# Altium project NBP7 Xilinx Virtex-II BGA456 Rev1.10.PrjPcb
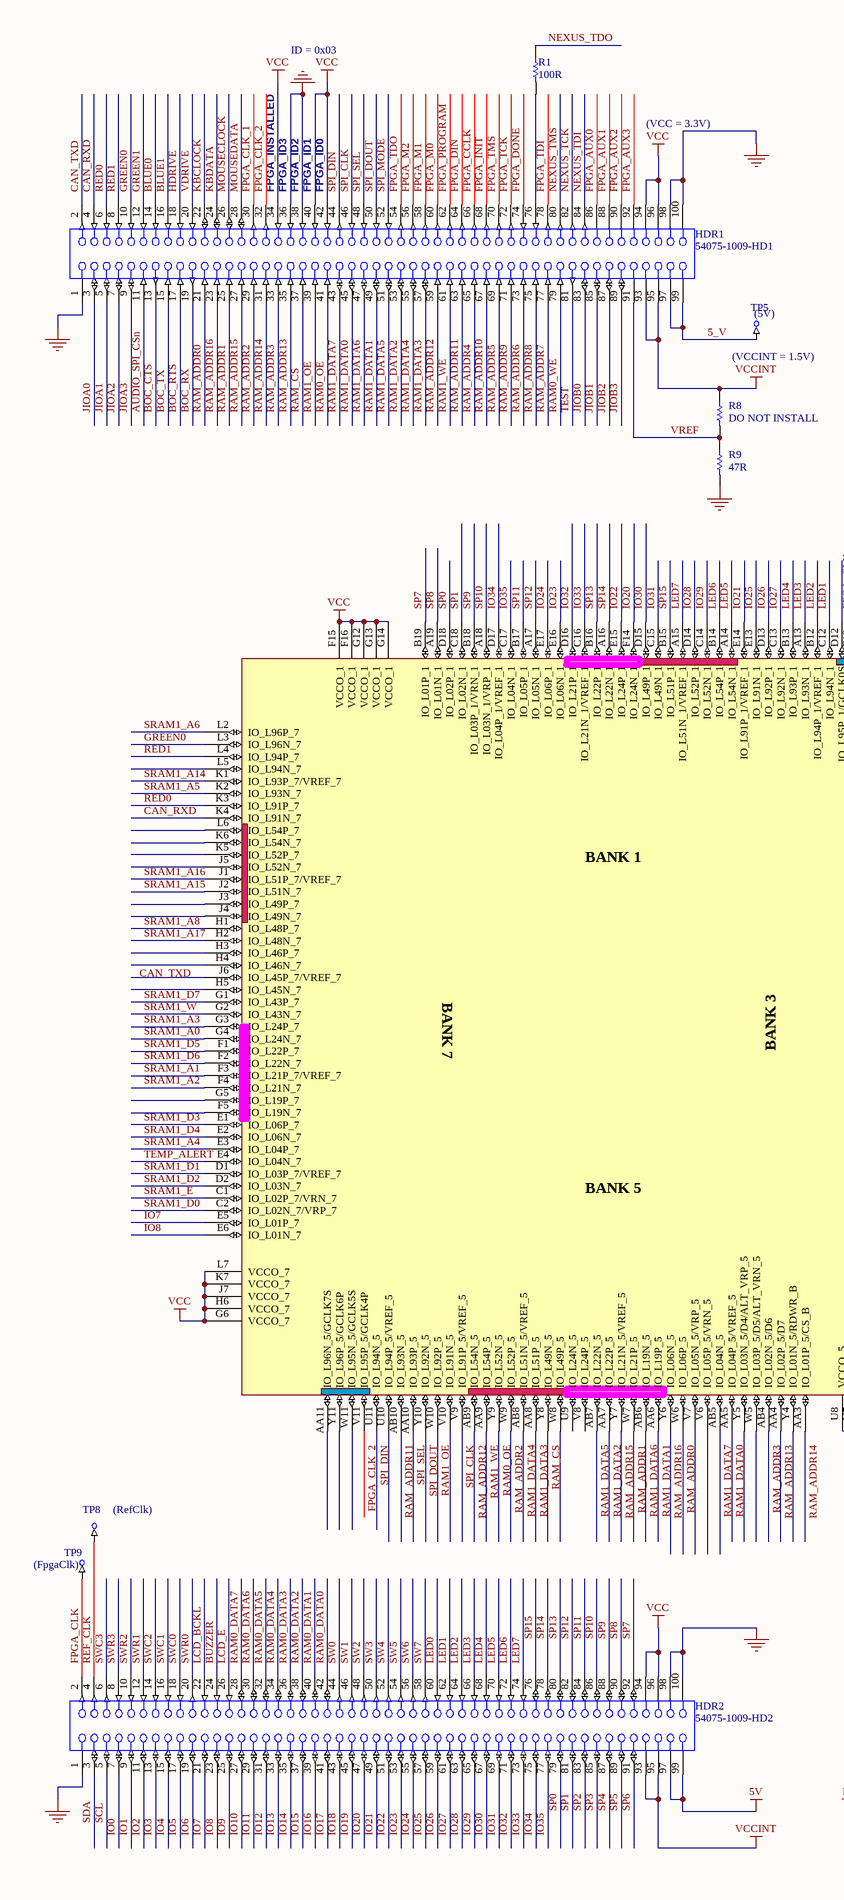
[diagram p0: NBP7 Xilinx Virtex-II BGA456 Rev1.10.SchDoc, left]
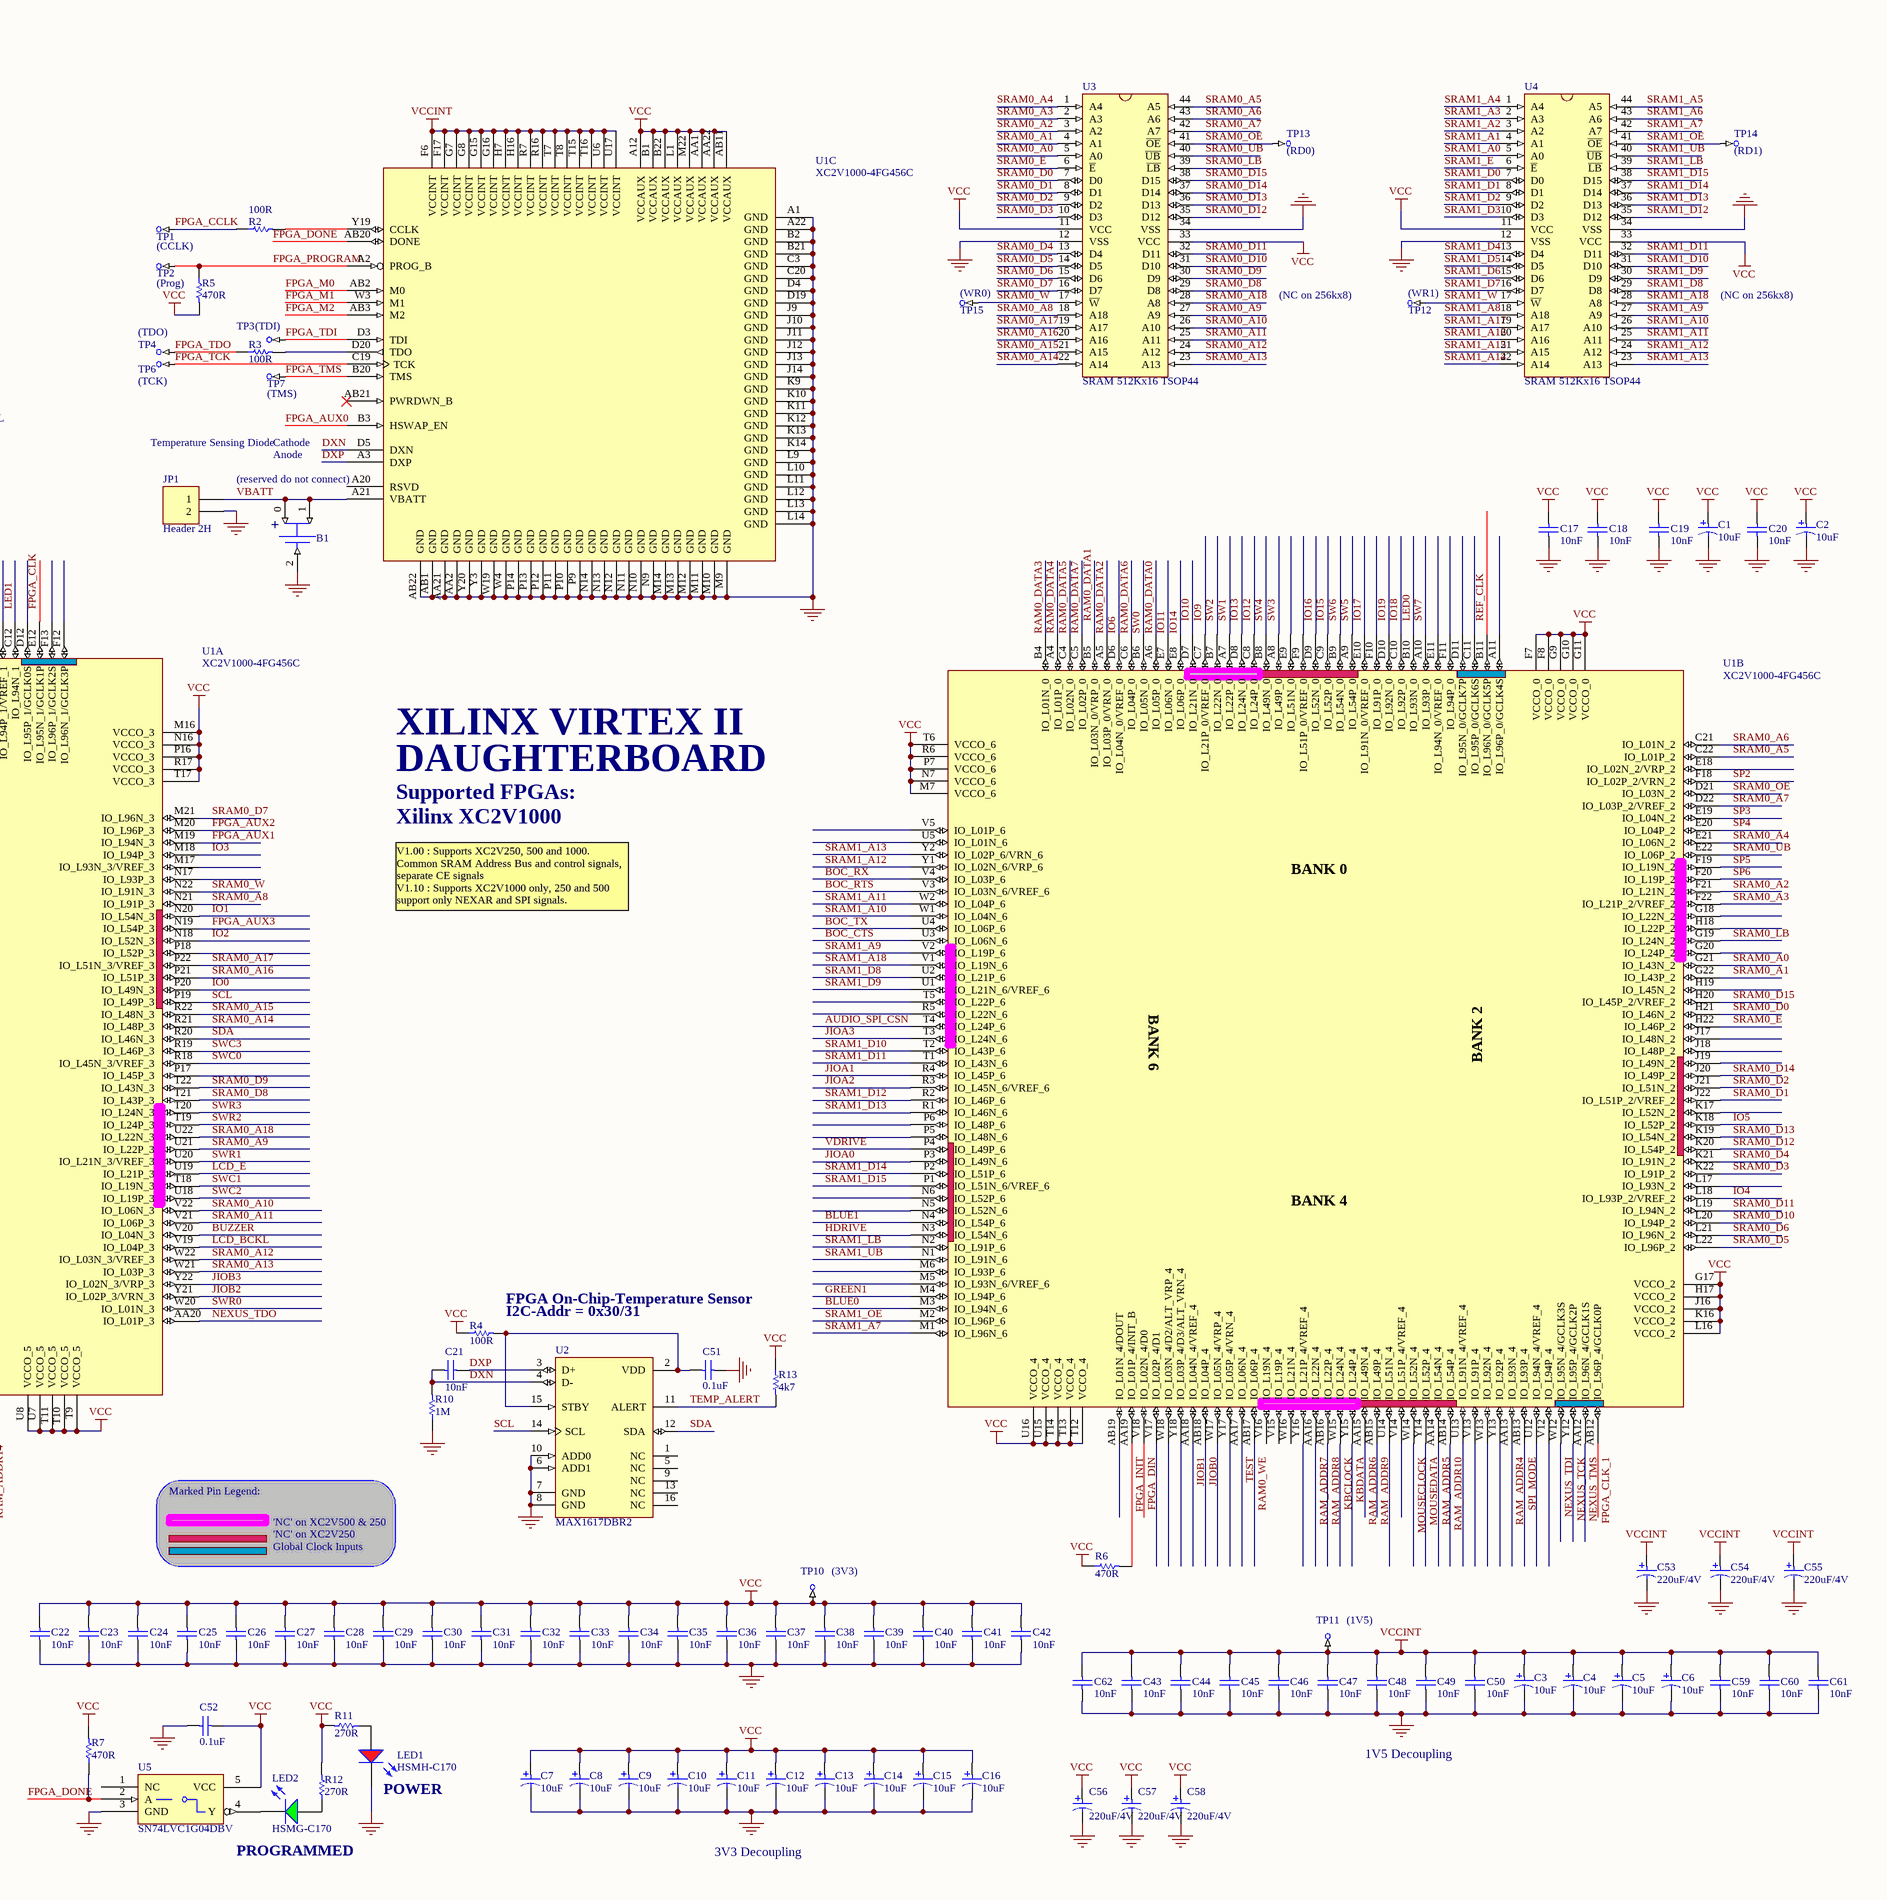
[diagram p1: NBP7 Xilinx Virtex-II BGA456 Rev1.10.SchDoc, right]
1 sheet, 101 parts. Net scope: global (net labels, ports and power ports of the same name join across sheets).
Board file: NBP7 Xilinx Virtex-II BGA456 Rev1.10.PcbDoc

## Sheet NBP7 Xilinx Virtex-II BGA456 Rev1.10.SchDoc: XILINX Virtex II Daughterboard
size A2; DrawnBy: Ch.W.; Organization: Altium Limited; Address1: L3, 12a Rodborough Rd; Address2: Frenchs Forest; Address3: NSW; Address4: Australia 2086; DocumentNumber: 1; Revision: 1.1; SheetNumber: 1; SheetTotal: 1

### Parts
B1  CoinCellHolder  [CoinCellHolder12THM]  (value not drawn)
C1  10uF  [MCCT-B]
C2  10uF  [MCCT-B]
C3  10uF  [MCCT-B]
C4  10uF  [MCCT-B]
C5  10uF  [MCCT-B]
C6  10uF  [MCCT-B]
C7  10uF  [MCCT-B]
C8  10uF  [MCCT-B]
C9  10uF  [MCCT-B]
C10  10uF  [MCCT-B]
C11  10uF  [MCCT-B]
C12  10uF  [MCCT-B]
C13  10uF  [MCCT-B]
C14  10uF  [MCCT-B]
C15  10uF  [MCCT-B]
C16  10uF  [MCCT-B]
C17  10nF  [CC1608-0603]
C18  10nF  [CC1608-0603]
C19  10nF  [CC1608-0603]
C20  10nF  [CC1608-0603]
C21  10nF  [CC1608-0603]
C22  10nF  [CC1608-0603]
C23  10nF  [CC1608-0603]
C24  10nF  [CC1608-0603]
C25  10nF  [CC1608-0603]
C26  10nF  [CC1608-0603]
C27  10nF  [CC1608-0603]
C28  10nF  [CC1608-0603]
C29  10nF  [CC1608-0603]
C30  10nF  [CC1608-0603]
C31  10nF  [CC1608-0603]
C32  10nF  [CC1608-0603]
C33  10nF  [CC1608-0603]
C34  10nF  [CC1608-0603]
C35  10nF  [CC1608-0603]
C36  10nF  [CC1608-0603]
C37  10nF  [CC1608-0603]
C38  10nF  [CC1608-0603]
C39  10nF  [CC1608-0603]
C40  10nF  [CC1608-0603]
C41  10nF  [CC1608-0603]
C42  10nF  [CC1608-0603]
C43  10nF  [CC1608-0603]
C44  10nF  [CC1608-0603]
C45  10nF  [CC1608-0603]
C46  10nF  [CC1608-0603]
C47  10nF  [CC1608-0603]
C48  10nF  [CC1608-0603]
C49  10nF  [CC1608-0603]
C50  10nF  [CC1608-0603]
C51  0.1uF  [CC2012-0805]
C52  0.1uF  [CC2012-0805]
C53  220uF/4V  [MCCT-D]
C54  220uF/4V  [MCCT-D]
C55  220uF/4V  [MCCT-D]
C56  220uF/4V  [MCCT-D]
C57  220uF/4V  [MCCT-D]
C58  220uF/4V  [MCCT-D]
C59  10nF  [CC1608-0603]
C60  10nF  [CC1608-0603]
C61  10nF  [CC1608-0603]
C62  10nF  [CC1608-0603]
HDR1  54075-1009-HD1  [54075]
HDR2  54075-1009-HD2  [54075]
JP1  Header 2H  [HDR1X2H]
LED1  HSMH-C170  [SMD _LED]
LED2  HSMG-C170  [SMD _LED]
R1  100R  [CC2012-0805]
R2  100R  [CC2012-0805]
R3  100R  [CC2012-0805]
R4  100R  [CC2012-0805]
R5  470R  [CC2012-0805]
R6  470R  [CC2012-0805]
R7  470R  [CC2012-0805]
R8  DO NOT INSTALL  [CC2012-0805]
R9  47R  [CC2012-0805]
R10  1M  [CC2012-0805]
R11  270R  [CC2012-0805]
R12  270R  [CC2012-0805]
R13  4k7  [CR2012-0805]
TP1  (CCLK)  [TestPin]  (no BOM)
TP2  (Prog)  [TestPin]  (no BOM)
TP3  (TDI)  [TestPin]  (no BOM)
TP4  (TDO)  [TestPin]  (no BOM)
TP5  (5V)  [TestPin]  (no BOM)
TP6  (TCK)  [TestPin]  (no BOM)
TP7  (TMS)  [TestPin]  (no BOM)
TP8  (RefClk)  [TestPin]  (no BOM)
TP9  (FpgaClk)  [TestPin]  (no BOM)
TP10  (3V3)  [TestPin]  (no BOM)
TP11  (1V5)  [TestPin]  (no BOM)
TP12  (WR1)  [TestPin]  (no BOM)
TP13  (RD0)  [TestPin]  (no BOM)
TP14  (RD1)  [TestPin]  (no BOM)
TP15  (WR0)  [TestPin]  (no BOM)
U1  XC2V1000-4FG456C  [FG456]  (parts A,B,C of 3)
U2  MAX1617DBR2  [QSOP16]
U3  SRAM 512Kx16 TSOP44  [SO-G44/P.8]
U4  SRAM 512Kx16 TSOP44  [SO-G44/P.8]
U5  SN74LVC1G04DBV  [SO-G5/P.95]

### Nets
5V: HDR2.97 HDR2.99
GND: B1.2 C1.2 C2.2 C3.2 C4.2 C5.2 C6.2 C7.2 C8.2 C9.2 C10.2 C11.2 C12.2 C13.2 C14.2 C15.2 C16.2 C17.2 C18.2 C19.2 C20.2 C22.2 C23.2 C24.2 C25.2 C26.2 C27.2 C28.2 C29.2 C30.2 C31.2 C32.2 C33.2 C34.2 C35.2 C36.2 C37.2 C38.2 C39.2 C40.2 C41.2 C42.2 C43.2 C44.2 C45.2 C46.2 C47.2 C48.2 C49.2 C50.2 C51.2 C52.2 C53.2 C54.2 C55.2 C56.2 C57.2 C58.2 C59.2 C60.2 C61.2 C62.2 HDR1.1 HDR1.36 HDR1.38 HDR1.98 HDR1.100 HDR2.1 HDR2.98 HDR2.100 JP1.2 LED1.2(K) R9.2 R10.1 U1.A1(GND) U1.A22(GND) U1.AA2(GND) U1.AA21(GND) U1.AB1(GND) U1.AB22(GND) U1.B2(GND) U1.B21(GND) U1.C3(GND) U1.C20(GND) U1.D4(GND) U1.D19(GND) U1.J9(GND) U1.J10(GND) U1.J11(GND) U1.J12(GND) U1.J13(GND) U1.J14(GND) U1.K9(GND) U1.K10(GND) U1.K11(GND) U1.K12(GND) U1.K13(GND) U1.K14(GND) U1.L9(GND) U1.L10(GND) U1.L11(GND) U1.L12(GND) U1.L13(GND) U1.L14(GND) U1.M9(GND) U1.M10(GND) U1.M11(GND) U1.M12(GND) U1.M13(GND) U1.M14(GND) U1.N9(GND) U1.N10(GND) U1.N11(GND) U1.N12(GND) U1.N13(GND) U1.N14(GND) U1.P9(GND) U1.P10(GND) U1.P11(GND) U1.P12(GND) U1.P13(GND) U1.P14(GND) U1.W4(GND) U1.W19(GND) U1.Y3(GND) U1.Y20(GND) U2.6(ADD1) U2.7(GND) U2.8(GND) U2.10(ADD0) U3.12(VSS) U3.34(VSS) U4.12(VSS) U4.34(VSS) U5.3(GND)
VCC: C1.1 C2.1 C7.1 C8.1 C9.1 C10.1 C11.1 C12.1 C13.1 C14.1 C15.1 C16.1 C17.1 C18.1 C19.1 C20.1 C22.1 C23.1 C24.1 C25.1 C26.1 C27.1 C28.1 C29.1 C30.1 C31.1 C32.1 C33.1 C34.1 C35.1 C36.1 C37.1 C38.1 C39.1 C40.1 C41.1 C42.1 C52.1 C56.1 C57.1 C58.1 HDR1.34 HDR1.40 HDR1.42 HDR1.94 HDR1.96 HDR2.94 HDR2.96 R4.1 R5.2 R6.1 R7.2 R11.2 R12.2 R13.1 TP10.1 U1.A12(VCCAUX) U1.AA1(VCCAUX) U1.AA22(VCCAUX) U1.AB11(VCCAUX) U1.B1(VCCAUX) U1.B22(VCCAUX) U1.F7(VCCO_0) U1.F8(VCCO_0) U1.F15(VCCO_1) U1.F16(VCCO_1) U1.G6(VCCO_7) U1.G9(VCCO_0) U1.G10(VCCO_0) U1.G11(VCCO_0) U1.G12(VCCO_1) U1.G13(VCCO_1) U1.G14(VCCO_1) U1.G17(VCCO_2) U1.H6(VCCO_7) U1.H17(VCCO_2) U1.J7(VCCO_7) U1.J16(VCCO_2) U1.K7(VCCO_7) U1.K16(VCCO_2) U1.L1(VCCAUX) U1.L7(VCCO_7) U1.L16(VCCO_2) U1.M7(VCCO_6) U1.M16(VCCO_3) U1.M22(VCCAUX) U1.N7(VCCO_6) U1.N16(VCCO_3) U1.P7(VCCO_6) U1.P16(VCCO_3) U1.R6(VCCO_6) U1.R17(VCCO_3) U1.T6(VCCO_6) U1.T9(VCCO_5) U1.T10(VCCO_5) U1.T11(VCCO_5) U1.T12(VCCO_4) U1.T13(VCCO_4) U1.T14(VCCO_4) U1.T17(VCCO_3) U1.U7(VCCO_5) U1.U8(VCCO_5) U1.U15(VCCO_4) U1.U16(VCCO_4) U3.11(VCC) U3.33(VCC) U4.11(VCC) U4.33(VCC) U5.5(VCC)
VCCINT: C3.1 C4.1 C5.1 C6.1 C43.1 C44.1 C45.1 C46.1 C47.1 C48.1 C49.1 C50.1 C53.1 C54.1 C55.1 C59.1 C60.1 C61.1 C62.1 HDR1.93 HDR1.95 HDR2.93 HDR2.95 R8.1 TP11.1 U1.F6(VCCINT) U1.F17(VCCINT) U1.G7(VCCINT) U1.G8(VCCINT) U1.G15(VCCINT) U1.G16(VCCINT) U1.H7(VCCINT) U1.H16(VCCINT) U1.R7(VCCINT) U1.R16(VCCINT) U1.T7(VCCINT) U1.T8(VCCINT) U1.T15(VCCINT) U1.T16(VCCINT) U1.U6(VCCINT) U1.U17(VCCINT)
5_V: HDR1.97 HDR1.99 TP5.1
AUDIO_SPI_CSn: HDR1.11 U1.T4(IO_L24P_6)
BLUE0: HDR1.14 U1.M3(IO_L94N_6)
BLUE1: HDR1.16 U1.N4(IO_L54P_6)
BOC_CTS: HDR1.13 U1.U3(IO_L06N_6)
BOC_RTS: HDR1.17 U1.V3(IO_L03N_6/VREF_6)
BOC_RX: HDR1.19 U1.V4(IO_L03P_6)
BOC_TX: HDR1.15 U1.U4(IO_L06P_6)
BUZZER: HDR2.24 U1.V20(IO_L04N_3)
CAN_RXD: HDR1.4 U1.K4(IO_L91N_7)
CAN_TXD: HDR1.2 U1.H4(IO_L46N_7)
DXN: C21.1 R10.2 U1.D5(DXN) U2.4(D-)
DXP: C21.2 U1.A3(DXP) U2.3(D+)
FPGA_AUX0: HDR1.86 U1.B3(HSWAP_EN)
FPGA_AUX1: HDR1.88 U1.M19(IO_L94N_3)
FPGA_AUX2: HDR1.90 U1.M20(IO_L96P_3)
FPGA_AUX3: HDR1.92 U1.N19(IO_L54P_3)
FPGA_CCLK: HDR1.66 R2.1 TP1.1
FPGA_CLK: HDR2.2 TP9.1 U1.E12(IO_L95N_1/GCLK1P)
FPGA_CLK_1: HDR1.30 U1.AB12(IO_L96P_4/GCLK0P)
FPGA_CLK_2: HDR1.32 U1.V11(IO_L95P_5/GCLK4P)
FPGA_DIN: HDR1.64 U1.V18(IO_L02N_4/D0)
FPGA_DONE: HDR1.74 R7.1 U1.AB20(DONE) U5.2(A)
FPGA_INIT: HDR1.68 R6.2 U1.AA19(IO_L01P_4/INIT_B)
FPGA_M0: HDR1.60 U1.AB2(M0)
FPGA_M1: HDR1.58 U1.W3(M1)
FPGA_M2: HDR1.56 U1.AB3(M2)
FPGA_PROGRAM: HDR1.62 R5.1 TP2.1 U1.A2(PROG_B)
FPGA_TCK: HDR1.72 TP6.1 U1.C19(TCK)
FPGA_TDI: HDR1.78 TP3.1 U1.D3(TDI)
FPGA_TDO: HDR1.54 R3.1 TP4.1
FPGA_TMS: HDR1.70 TP7.1 U1.B20(TMS)
GREEN0: HDR1.10 U1.L3(IO_L96N_7)
GREEN1: HDR1.12 U1.M4(IO_L94P_6)
HDRIVE: HDR1.18 U1.N3(IO_L54N_6)
IO0: HDR2.7 U1.P20(IO_L49N_3)
IO1: HDR2.9 U1.N20(IO_L54N_3)
IO2: HDR2.11 U1.N18(IO_L52N_3)
IO3: HDR2.13 U1.M18(IO_L94P_3)
IO4: HDR2.15 U1.L18(IO_L93P_2/VREF_2)
IO5: HDR2.17 U1.K18(IO_L52P_2)
IO6: HDR2.19 U1.D6(IO_L04N_0/VREF_0)
IO7: HDR2.21 U1.E5(IO_L01P_7)
IO8: HDR2.23 U1.E6(IO_L01N_7)
IO9: HDR2.25 U1.C7(IO_L21P_0/VREF_0)
IO10: HDR2.27 U1.D7(IO_L21N_0)
IO11: HDR2.29 U1.E7(IO_L06N_0)
IO12: HDR2.31 U1.C8(IO_L24P_0)
IO13: HDR2.33 U1.D8(IO_L24N_0)
IO14: HDR2.35 U1.E8(IO_L06P_0)
IO15: HDR2.37 U1.C9(IO_L52P_0)
IO16: HDR2.39 U1.D9(IO_L52N_0)
IO17: HDR2.41 U1.E10(IO_L91N_0/VREF_0)
IO18: HDR2.43 U1.C10(IO_L92P_0)
IO19: HDR2.45 U1.D10(IO_L92N_0)
IO20: HDR2.47 U1.F14(IO_L24N_1)
IO21: HDR2.49 U1.E14(IO_L91P_1/VREF_1)
IO22: HDR2.51 U1.E15(IO_L24P_1)
IO23: HDR2.53 U1.E16(IO_L06N_1)
IO24: HDR2.55 U1.E17(IO_L06P_1)
IO25: HDR2.57 U1.E13(IO_L91N_1)
IO26: HDR2.59 U1.D13(IO_L92P_1)
IO27: HDR2.61 U1.C13(IO_L92N_1)
IO28: HDR2.63 U1.D14(IO_L52P_1)
IO29: HDR2.65 U1.C14(IO_L52N_1)
IO30: HDR2.67 U1.D15(IO_L49P_1)
IO31: HDR2.69 U1.C15(IO_L49N_1)
IO32: HDR2.71 U1.D16(IO_L21P_1)
IO33: HDR2.73 U1.C16(IO_L21N_1/VREF_1)
IO34: HDR2.75 U1.D17(IO_L04P_1/VREF_1)
IO35: HDR2.77 U1.C17(IO_L04N_1)
JIOA0: HDR1.3 U1.P3(IO_L49N_6)
JIOA1: HDR1.5 U1.R4(IO_L45P_6)
JIOA2: HDR1.7 U1.R3(IO_L45N_6/VREF_6)
JIOA3: HDR1.9 U1.T3(IO_L24N_6)
JIOB0: HDR1.83 U1.AB18(IO_L04P_4)
JIOB1: HDR1.85 U1.AA18(IO_L04N_4/VREF_4)
JIOB2: HDR1.87 U1.Y21(IO_L02P_3/VRN_3)
JIOB3: HDR1.89 U1.Y22(IO_L02N_3/VRP_3)
KBCLOCK: HDR1.22 U1.W15(IO_L24N_4)
KBDATA: HDR1.24 U1.Y15(IO_L24P_4)
LCD_BCKL: HDR2.22 U1.V19(IO_L04P_3)
LCD_E: HDR2.26 U1.U19(IO_L21P_3)
LED0: HDR2.60 U1.B10(IO_L93N_0)
LED1: HDR2.62 U1.C12(IO_L94N_1)
LED2: HDR2.64 U1.B12(IO_L94P_1/VREF_1)
LED3: HDR2.66 U1.A13(IO_L93N_1)
LED4: HDR2.68 U1.B13(IO_L93P_1)
LED5: HDR2.70 U1.A14(IO_L54N_1)
LED6: HDR2.72 U1.B14(IO_L54P_1)
LED7: HDR2.74 U1.A15(IO_L51N_1/VREF_1)
MOUSECLOCK: HDR1.26 U1.W14(IO_L52N_4)
MOUSEDATA: HDR1.28 U1.Y14(IO_L52P_4)
NEXUS_TCK: HDR1.82 U1.Y12(IO_L95P_4/GCLK2P)
NEXUS_TDI: HDR1.84 U1.W12(IO_L95N_4/GCLK3S)
NEXUS_TDO: R1.1 U1.AA20(IO_L01P_3)
NEXUS_TMS: HDR1.80 U1.AA12(IO_L96N_4/GCLK1S)
RAM0_DATA0: HDR2.42 U1.A6(IO_L05P_0)
RAM0_DATA1: HDR2.40 U1.B5(IO_L03N_0/VRP_0)
RAM0_DATA2: HDR2.38 U1.A5(IO_L03P_0/VRN_0)
RAM0_DATA3: HDR2.36 U1.B4(IO_L01N_0)
RAM0_DATA4: HDR2.34 U1.A4(IO_L01P_0)
RAM0_DATA5: HDR2.32 U1.C4(IO_L02N_0)
RAM0_DATA6: HDR2.30 U1.C6(IO_L04P_0)
RAM0_DATA7: HDR2.28 U1.C5(IO_L02P_0)
RAM0_OE: HDR1.41 U1.Y9(IO_L52N_5)
RAM0_WE: HDR1.79 U1.AB17(IO_L06P_4)
RAM1_DATA0: HDR1.45 U1.AA5(IO_L04P_5/VREF_5)
RAM1_DATA1: HDR1.49 U1.AA6(IO_L19P_5)
RAM1_DATA2: HDR1.53 U1.AA7(IO_L22P_5)
RAM1_DATA3: HDR1.57 U1.AA8(IO_L51P_5)
RAM1_DATA4: HDR1.55 U1.AB8(IO_L51N_5/VREF_5)
RAM1_DATA5: HDR1.51 U1.AB7(IO_L22N_5)
RAM1_DATA6: HDR1.47 U1.AB6(IO_L19N_5)
RAM1_DATA7: HDR1.43 U1.AB5(IO_L04N_5)
RAM1_OE: HDR1.39 U1.W10(IO_L92P_5)
RAM1_WE: HDR1.61 U1.AA9(IO_L54P_5)
RAM_ADDR0: HDR1.21 U1.W6(IO_L06P_5)
RAM_ADDR1: HDR1.25 U1.W7(IO_L21P_5)
RAM_ADDR2: HDR1.29 U1.W9(IO_L52P_5)
RAM_ADDR3: HDR1.33 U1.AB4(IO_L02N_5/D6)
RAM_ADDR4: HDR1.65 U1.AA13(IO_L93N_4)
RAM_ADDR5: HDR1.69 U1.AA14(IO_L54N_4)
RAM_ADDR6: HDR1.73 U1.AA15(IO_L49N_4)
RAM_ADDR7: HDR1.77 U1.AA16(IO_L22N_4)
RAM_ADDR8: HDR1.75 U1.AB16(IO_L22P_4)
RAM_ADDR9: HDR1.71 U1.AB15(IO_L49P_4)
RAM_ADDR10: HDR1.67 U1.AB14(IO_L54P_4)
RAM_ADDR11: HDR1.63 U1.AB10(IO_L93N_5)
RAM_ADDR12: HDR1.59 U1.AB9(IO_L54N_5)
RAM_ADDR13: HDR1.35 U1.AA4(IO_L02P_5/D7)
RAM_ADDR14: HDR1.31 U1.AA3(IO_L01P_5/CS_B)
RAM_ADDR15: HDR1.27 U1.Y7(IO_L21N_5/VREF_5)
RAM_ADDR16: HDR1.23 U1.Y6(IO_L06N_5)
RAM_CS: HDR1.37 U1.Y8(IO_L49N_5)
RED0: HDR1.6 U1.K3(IO_L91P_7)
RED1: HDR1.8 U1.L4(IO_L94P_7)
REF_CLK: HDR2.4 TP8.1 U1.B11(IO_L96N_0/GCLK5P)
SCL: HDR2.5 U1.P19(IO_L49P_3) U2.14(SCL)
SDA: HDR2.3 U1.R20(IO_L46N_3) U2.12(SDA)
SP0: HDR2.79 U1.D18(IO_L02P_1)
SP1: HDR2.81 U1.C18(IO_L02N_1)
SP2: HDR2.83 U1.F18(IO_L02P_2/VRN_2)
SP3: HDR2.85 U1.E19(IO_L04N_2)
SP4: HDR2.87 U1.E20(IO_L04P_2)
SP5: HDR2.89 U1.F19(IO_L19N_2)
SP6: HDR2.91 U1.F20(IO_L19P_2)
SP7: HDR2.92 U1.B19(IO_L01P_1)
SP8: HDR2.90 U1.A19(IO_L01N_1)
SP9: HDR2.88 U1.B18(IO_L03P_1/VRN_1)
SP10: HDR2.86 U1.A18(IO_L03N_1/VRP_1)
SP11: HDR2.84 U1.B17(IO_L05P_1)
SP12: HDR2.82 U1.A17(IO_L05N_1)
SP13: HDR2.80 U1.B16(IO_L22P_1)
SP14: HDR2.78 U1.A16(IO_L22N_1)
SP15: HDR2.76 U1.B15(IO_L51P_1)
SPI_CLK: HDR1.46 U1.V9(IO_L91P_5/VREF_5)
SPI_DIN: HDR1.44 U1.U11(IO_L94N_5)
SPI_DOUT: HDR1.50 U1.Y10(IO_L92N_5)
SPI_MODE: HDR1.52 U1.AB13(IO_L93P_4)
SPI_SEL: HDR1.48 U1.AA10(IO_L93P_5)
SRAM0_A0: U1.G21(IO_L43N_2) U3.5(A0)
SRAM0_A1: U1.G22(IO_L43P_2) U3.4(A1)
SRAM0_A2: U1.F21(IO_L21N_2) U3.3(A2)
SRAM0_A3: U1.F22(IO_L21P_2/VREF_2) U3.2(A3)
SRAM0_A4: U1.E21(IO_L06N_2) U3.1(A4)
SRAM0_A5: U1.C22(IO_L01P_2) U3.44(A5)
SRAM0_A6: U1.C21(IO_L01N_2) U3.43(A6)
SRAM0_A7: U1.D22(IO_L03P_2/VREF_2) U3.42(A7)
SRAM0_A8: U1.N21(IO_L91P_3) U3.18(A18)
SRAM0_A9: U1.U21(IO_L22P_3) U3.27(A9)
SRAM0_A10: U1.V22(IO_L06N_3) U3.26(A10)
SRAM0_A11: U1.V21(IO_L06P_3) U3.25(A11)
SRAM0_A12: U1.W22(IO_L03N_3/VREF_3) U3.24(A12)
SRAM0_A13: U1.W21(IO_L03P_3) U3.23(A13)
SRAM0_A14: U1.R21(IO_L48P_3) U3.22(A14)
SRAM0_A15: U1.R22(IO_L48N_3) U3.21(A15)
SRAM0_A16: U1.P21(IO_L51P_3) U3.20(A16)
SRAM0_A17: U1.P22(IO_L51N_3/VREF_3) U3.19(A17)
SRAM0_A18: U1.U22(IO_L22N_3) U3.28(A8)
SRAM0_D0: U1.H21(IO_L46N_2) U3.7(D0)
SRAM0_D1: U1.J22(IO_L51P_2/VREF_2) U3.8(D1)
SRAM0_D2: U1.J21(IO_L51N_2) U3.9(D2)
SRAM0_D3: U1.K22(IO_L91P_2) U3.10(D3)
SRAM0_D4: U1.K21(IO_L91N_2) U3.13(D4)
SRAM0_D5: U1.L22(IO_L96P_2) U3.14(D5)
SRAM0_D6: U1.L21(IO_L96N_2) U3.15(D6)
SRAM0_D7: U1.M21(IO_L96N_3) U3.16(D7)
SRAM0_D8: U1.T21(IO_L43P_3) U3.29(D8)
SRAM0_D9: U1.T22(IO_L43N_3) U3.30(D9)
SRAM0_D10: U1.L20(IO_L94P_2) U3.31(D10)
SRAM0_D11: U1.L19(IO_L94N_2) U3.32(D11)
SRAM0_D12: U1.K20(IO_L54P_2) U3.35(D12)
SRAM0_D13: U1.K19(IO_L54N_2) U3.36(D13)
SRAM0_D14: U1.J20(IO_L49P_2) U3.37(D14)
SRAM0_D15: U1.H20(IO_L45P_2/VREF_2) U3.38(D15)
SRAM0_E: U1.H22(IO_L46P_2) U3.6(~{E})
SRAM0_LB: U1.G19(IO_L24N_2) U3.39(~{LB})
SRAM0_OE: TP13.1 U1.D21(IO_L03N_2) U3.41(~{OE})
SRAM0_UB: U1.E22(IO_L06P_2) U3.40(~{UB})
SRAM0_W: TP15.1 U1.N22(IO_L91N_3) U3.17(~{W})
SRAM1_A0: U1.G4(IO_L24N_7) U4.5(A0)
SRAM1_A1: U1.F3(IO_L21P_7/VREF_7) U4.4(A1)
SRAM1_A2: U1.F4(IO_L21N_7) U4.3(A2)
SRAM1_A3: U1.G3(IO_L24P_7) U4.2(A3)
SRAM1_A4: U1.E3(IO_L04P_7) U4.1(A4)
SRAM1_A5: U1.K2(IO_L93N_7) U4.44(A5)
SRAM1_A6: U1.L2(IO_L96P_7) U4.43(A6)
SRAM1_A7: U1.M1(IO_L96N_6) U4.42(A7)
SRAM1_A8: U1.H1(IO_L48P_7) U4.18(A18)
SRAM1_A9: U1.V2(IO_L19P_6) U4.27(A9)
SRAM1_A10: U1.W1(IO_L04N_6) U4.26(A10)
SRAM1_A11: U1.W2(IO_L04P_6) U4.25(A11)
SRAM1_A12: U1.Y1(IO_L02N_6/VRP_6) U4.24(A12)
SRAM1_A13: U1.Y2(IO_L02P_6/VRN_6) U4.23(A13)
SRAM1_A14: U1.K1(IO_L93P_7/VREF_7) U4.22(A14)
SRAM1_A15: U1.J2(IO_L51N_7) U4.21(A15)
SRAM1_A16: U1.J1(IO_L51P_7/VREF_7) U4.20(A16)
SRAM1_A17: U1.H2(IO_L48N_7) U4.19(A17)
SRAM1_A18: U1.V1(IO_L19N_6) U4.28(A8)
SRAM1_D0: U1.C2(IO_L02N_7/VRP_7) U4.7(D0)
SRAM1_D1: U1.D1(IO_L03P_7/VREF_7) U4.8(D1)
SRAM1_D2: U1.D2(IO_L03N_7) U4.9(D2)
SRAM1_D3: U1.E1(IO_L06P_7) U4.10(D3)
SRAM1_D4: U1.E2(IO_L06N_7) U4.13(D4)
SRAM1_D5: U1.F1(IO_L22P_7) U4.14(D5)
SRAM1_D6: U1.F2(IO_L22N_7) U4.15(D6)
SRAM1_D7: U1.G1(IO_L43P_7) U4.16(D7)
SRAM1_D8: U1.U2(IO_L21P_6) U4.29(D8)
SRAM1_D9: U1.U1(IO_L21N_6/VREF_6) U4.30(D9)
SRAM1_D10: U1.T2(IO_L43P_6) U4.31(D10)
SRAM1_D11: U1.T1(IO_L43N_6) U4.32(D11)
SRAM1_D12: U1.R2(IO_L46P_6) U4.35(D12)
SRAM1_D13: U1.R1(IO_L46N_6) U4.36(D13)
SRAM1_D14: U1.P2(IO_L51P_6) U4.37(D14)
SRAM1_D15: U1.P1(IO_L51N_6/VREF_6) U4.38(D15)
SRAM1_E: U1.C1(IO_L02P_7/VRN_7) U4.6(~{E})
SRAM1_LB: U1.N2(IO_L91P_6) U4.39(~{LB})
SRAM1_OE: TP14.1 U1.M2(IO_L96P_6) U4.41(~{OE})
SRAM1_UB: U1.N1(IO_L91N_6) U4.40(~{UB})
SRAM1_W: TP12.1 U1.G2(IO_L43N_7) U4.17(~{W})
SW0: HDR2.44 U1.B6(IO_L05N_0)
SW1: HDR2.46 U1.A7(IO_L22P_0)
SW2: HDR2.48 U1.B7(IO_L22N_0)
SW3: HDR2.50 U1.A8(IO_L49P_0)
SW4: HDR2.52 U1.B8(IO_L49N_0)
SW5: HDR2.54 U1.A9(IO_L54P_0)
SW6: HDR2.56 U1.B9(IO_L54N_0)
SW7: HDR2.58 U1.A10(IO_L93P_0)
SWC0: HDR2.18 U1.R18(IO_L45N_3/VREF_3)
SWC1: HDR2.16 U1.T18(IO_L19N_3)
SWC2: HDR2.14 U1.U18(IO_L19P_3)
SWC3: HDR2.6 U1.R19(IO_L46P_3)
SWR0: HDR2.20 U1.W20(IO_L01N_3)
SWR1: HDR2.12 U1.U20(IO_L21N_3/VREF_3)
SWR2: HDR2.10 U1.T19(IO_L24P_3)
SWR3: HDR2.8 U1.T20(IO_L24N_3)
TEMP_ALERT: R13.2 U1.E4(IO_L04N_7) U2.11(ALERT)
TEST: HDR1.81 U1.AA17(IO_L06N_4)
VBATT: B1.0 B1.1 JP1.1 U1.A21(VBATT)
VDRIVE: HDR1.20 U1.P4(IO_L49P_6)
VREF: HDR1.91 R8.2 R9.1
NetC51_1: C51.1 R4.2 U2.2(VDD) U2.15(STBY)
NetHDR1_76: HDR1.76 R1.2
NetLED1_1: LED1.1(A) R11.1
NetLED2_1: LED2.1(A) R12.1
NetLED2_2: LED2.2(K) U5.4(Y)
NetR2_2: R2.2 U1.Y19(CCLK)
NetR3_2: R3.2 U1.D20(TDO)

Not connected (* = marked no-connect by the designer): U1 A11(IO_L96P_0/GCLK4S) A20(RSVD) AA11(IO_L96N_5/GCLK7S) AB19(IO_L01N_4/DOUT) AB21(PWRDWN_B)* C11(IO_L95P_0/GCLK6S) D11(IO_L95N_0/GCLK7P) D12(IO_L95P_1/GCLK0S) E9(IO_L51N_0) E11(IO_L94N_0/VREF_0) E18(IO_L02N_2/VRP_2) F5(IO_L19N_7) F9(IO_L51P_0/VREF_0) F10(IO_L91P_0) F11(IO_L94P_0) F12(IO_L96N_1/GCLK3P) F13(IO_L96P_1/GCLK2S) G5(IO_L19P_7) G18(IO_L22N_2) G20(IO_L24P_2) H3(IO_L46P_7) H5(IO_L45N_7) H18(IO_L22P_2) H19(IO_L45N_2) J3(IO_L49P_7) J4(IO_L49N_7) J5(IO_L52N_7) J6(IO_L45P_7/VREF_7) J17(IO_L48N_2) J18(IO_L48P_2) J19(IO_L49N_2) K5(IO_L52P_7) K6(IO_L54N_7) K17(IO_L52N_2) L5(IO_L94N_7) L6(IO_L54P_7) L17(IO_L93N_2) M5(IO_L93N_6/VREF_6) M6(IO_L93P_6) M17(IO_L93N_3/VREF_3) N5(IO_L52N_6) N6(IO_L52P_6) N17(IO_L93P_3) P5(IO_L48N_6) P6(IO_L48P_6) P17(IO_L45P_3) P18(IO_L52P_3) R5(IO_L22N_6) T5(IO_L22P_6) U5(IO_L01N_6) U9(IO_L24N_5) U10(IO_L94P_5/VREF_5) U12(IO_L94N_4/VREF_4) U13(IO_L91N_4/VREF_4) U14(IO_L51N_4) V5(IO_L01P_6) V6(IO_L05P_5/VRN_5) V7(IO_L05N_5/VRP_5) V8(IO_L24P_5) V10(IO_L91N_5) V12(IO_L94P_4) V13(IO_L91P_4) V14(IO_L51P_4/VREF_4) V15(IO_L19P_4) V16(IO_L19N_4) V17(IO_L02P_4/D1) W5(IO_L03P_5/D5/ALT_VRN_5) W8(IO_L49P_5) W11(IO_L95N_5/GCLK5S) W13(IO_L92N_4) W16(IO_L21N_4) W17(IO_L05N_4/VRP_4) W18(IO_L03N_4/D2/ALT_VRP_4) Y4(IO_L01N_5/RDWR_B) Y5(IO_L03N_5/D4/ALT_VRP_5) Y11(IO_L96P_5/GCLK6P) Y13(IO_L92P_4) Y16(IO_L21P_4/VREF_4) Y17(IO_L05P_4/VRN_4) Y18(IO_L03P_4/D3/ALT_VRN_4); U2 1(NC) 5(NC) 9(NC) 13(NC) 16(NC); U5 1(NC)

### Notes on the sheet
- ID = 0x03
- (VCC = 3.3V)
- (near HDR1) FPGA_INSTALLED
- (near HDR1) FPGA_ID3
- (near HDR1) FPGA_ID2
- (near HDR1) FPGA_ID1
- (near HDR1) FPGA_ID0
- (NC on 256kx8)
- (VCCINT = 1.5V)
- Temperature Sensing Diode
- Anode
- Cathode
- (near U1) (reserved do not connect)
- XILINX VIRTEX II
- DAUGHTERBOARD
- Supported FPGAs:
- Xilinx XC2V1000
- V1.00 : Supports XC2V250, 500 and 1000. Common SRAM Address Bus and control signals, separate CE signals
  V1.10 : Supports XC2V1000 only, 250 and 500 support only NEXAR and SPI signals.
- (near R4) FPGA On-Chip-Temperature Sensor
- (near R4) I2C-Addr = 0x30/31
- Marked Pin Legend:
- 'NC' on XC2V250
- Global Clock Inputs
- 'NC' on XC2V500 & 250
- (near LED1) POWER
- 1V5 Decoupling
- PROGRAMMED
- 3V3 Decoupling
- Title
- Size:
- Date:
- File:
- A2
- Number:
- Time:
- Revision:
- Sheet
- of
- (in symbol CoinCellHolder) +
- (in symbol XC2V1000-4FG456C, part A) BANK 1; BANK 7; BANK 3; BANK 5
- (in symbol XC2V1000-4FG456C, part B) BANK 0; BANK 6; BANK 2; BANK 4

### Library data of the parts
C1-C16 C53-C58 = CAP_POLAR: Polar Capacitor; Supplier: FARNELL
  C1-C16: Supplier Code: 967-117
  C53-C58: Supplier Code: 355-1829
C17-C52 C59-C62 = CAP: Capacitor; Supplier: FARNELL
  C17-C50 C59-C62: Supplier Code: 772-236
  C51 C52: Supplier Code: 499-687
HDR1 = 54075-1009-HD1: Board-to-Board, Docking Station, 0.80mm (.031") Pitch, Shielded Receptacle, Vertical, Ultra Low Profile, SMT; Manufacturer: Molex; Package Information: Latest Revision: Jun-2001; Mating Height: 8.5mm; Voltage: 100V; Current: 0.5A; Contact Resistance: 40mOhm max; PCB Layout: Complies with Manufacturer's Recommendation.; Published: 15-Oct-2003; Datasheet: Latest Revision: Feb-2002; Package Reference: 54075; Publisher: Altium Limited
HDR2 = 54075-1009-HD2: Board-to-Board, Docking Station, 0.80mm (.031") Pitch, Shielded Receptacle, Vertical, Ultra Low Profile, SMT; Manufacturer: Molex; Package Information: Latest Revision: Jun-2001; Mating Height: 8.5mm; Voltage: 100V; Current: 0.5A; Contact Resistance: 40mOhm max; PCB Layout: Complies with Manufacturer's Recommendation.; Published: 15-Oct-2003; Datasheet: Latest Revision: Feb-2002; Package Reference: 54075; Publisher: Altium Limited
JP1 = Header 2H: Header, 2-Pin, Right Angle; Revision: 17-Jul-2002: Re-released for DXP Platform.; Publisher: Altium Limited
LED1 = HSMX-C670: Typical RED GaAs SMD LED Agilent make; Manufacturer: Generic Components; Class I: Optoelectronic; Fitted: True; Published: 8-Jun-2000; Revision: July-2002: Re-released for DXP Platform.; Publisher: Altium Limited; Class II: LED
LED2 = HSMX-C670: Typical GREEN GaAs SMD LED Agilent make; Manufacturer: Generic Components; Class I: Optoelectronic; Fitted: True; Published: 8-Jun-2000; Revision: July-2002: Re-released for DXP Platform.; Publisher: Altium Limited; Class II: LED
R1-R13 = RES: Resistor
TP1-TP15 = TestPin
U1 = XC2V1000-4FG456C: Virtex-II 1.5V FPGA, 456-Ball FBGA, Commercial Grade; Package Information: Latest Revision: ver1.1, Apr-2001; Code - JEDEC: MO-151-AAJ-1; Published: 15-Apr-2002; Datasheet: Latest Revision: Aug-2003; Package Reference: FG456; Publisher: Altium Limited
U2 = MAX1617DBR2: SMBus Temperature Sensor with Internal and External Diode Input; Package Information: Latest Revision: Feb-2000; Published: 17-Jul-2002; Datasheet: Latest Revision: Feb-2000; Package Reference: QSOP16; Publisher: Altium Limited
U3 U4 = SRAM 512Kx16 TSOP44: 512Kx16Bit SRAM TSOP44; Supplier: IDT; Supplier Code: 71V416L10PH
U5 = SN74AHC1G04DBVR: Manufacturer: TI; Fitted: True
B1 = CoinCellHolder: Supplier: FARNELL; Supplier Code: 908-642